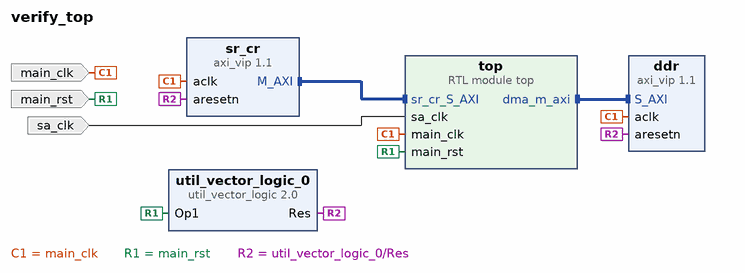
[diagram p0: block diagram of the top level]
# Vivado block design verify_top, xcvu9p-flga2104-2L-e, Vivado 2022.1
create_bd_design verify_top

create_bd_port -dir I -type clk main_clk
set_property -dict {CONFIG.FREQ_HZ 250000000} [get_bd_ports main_clk]
create_bd_port -dir I -type rst main_rst
set_property -dict {CONFIG.POLARITY ACTIVE_HIGH} [get_bd_ports main_rst]
create_bd_port -dir I -type clk sa_clk
set_property -dict {CONFIG.FREQ_HZ 398437500} [get_bd_ports sa_clk]

create_bd_cell -type ip -vlnv xilinx.com:ip:axi_vip:1.1 sr_cr
set_property -dict [list \
  CONFIG.ADDR_WIDTH 32 \
  CONFIG.DATA_WIDTH 32 \
  CONFIG.HAS_BRESP 1 \
  CONFIG.HAS_PROT 1 \
  CONFIG.HAS_RRESP 1 \
  CONFIG.HAS_WSTRB 1 \
  CONFIG.INTERFACE_MODE MASTER \
  CONFIG.PROTOCOL AXI4LITE \
  CONFIG.READ_WRITE_MODE READ_WRITE \
] [get_bd_cells sr_cr]
create_bd_cell -type ip -vlnv xilinx.com:ip:axi_vip:1.1 ddr
set_property -dict {CONFIG.DATA_WIDTH 512 CONFIG.INTERFACE_MODE SLAVE} [get_bd_cells ddr]
create_bd_cell -type module -reference top top
create_bd_cell -type ip -vlnv xilinx.com:ip:util_vector_logic:2.0 util_vector_logic_0
set_property -dict {CONFIG.C_OPERATION not CONFIG.C_SIZE 1} [get_bd_cells util_vector_logic_0]

# ---- connections ----

connect_bd_intf_net [get_bd_intf_pins sr_cr/M_AXI] [get_bd_intf_pins top/sr_cr_S_AXI]
connect_bd_intf_net [get_bd_intf_pins ddr/S_AXI] [get_bd_intf_pins top/dma_m_axi]
connect_bd_net -net main_clk_0_1 [get_bd_ports main_clk] [get_bd_pins ddr/aclk] [get_bd_pins sr_cr/aclk] [get_bd_pins top/main_clk]
connect_bd_net -net main_rst_0_1 [get_bd_ports main_rst] [get_bd_pins top/main_rst] [get_bd_pins util_vector_logic_0/Op1]
connect_bd_net -net sa_clk_0_1 [get_bd_ports sa_clk] [get_bd_pins top/sa_clk]
connect_bd_net [get_bd_pins util_vector_logic_0/Res] [get_bd_pins ddr/aresetn] [get_bd_pins sr_cr/aresetn]

# ---- address map ----
assign_bd_address -offset 0x00000000 -range 4K -target_address_space [get_bd_addr_spaces sr_cr/Master_AXI] [get_bd_addr_segs top/sr_cr_S_AXI/reg0]
assign_bd_address -offset 0x80000000 -range 2G -target_address_space [get_bd_addr_spaces top/dma_m_axi] [get_bd_addr_segs ddr/S_AXI/Reg]

validate_bd_design
save_bd_design
